# EAGLE design Breakouts1 (EAGLE 7.2.0)
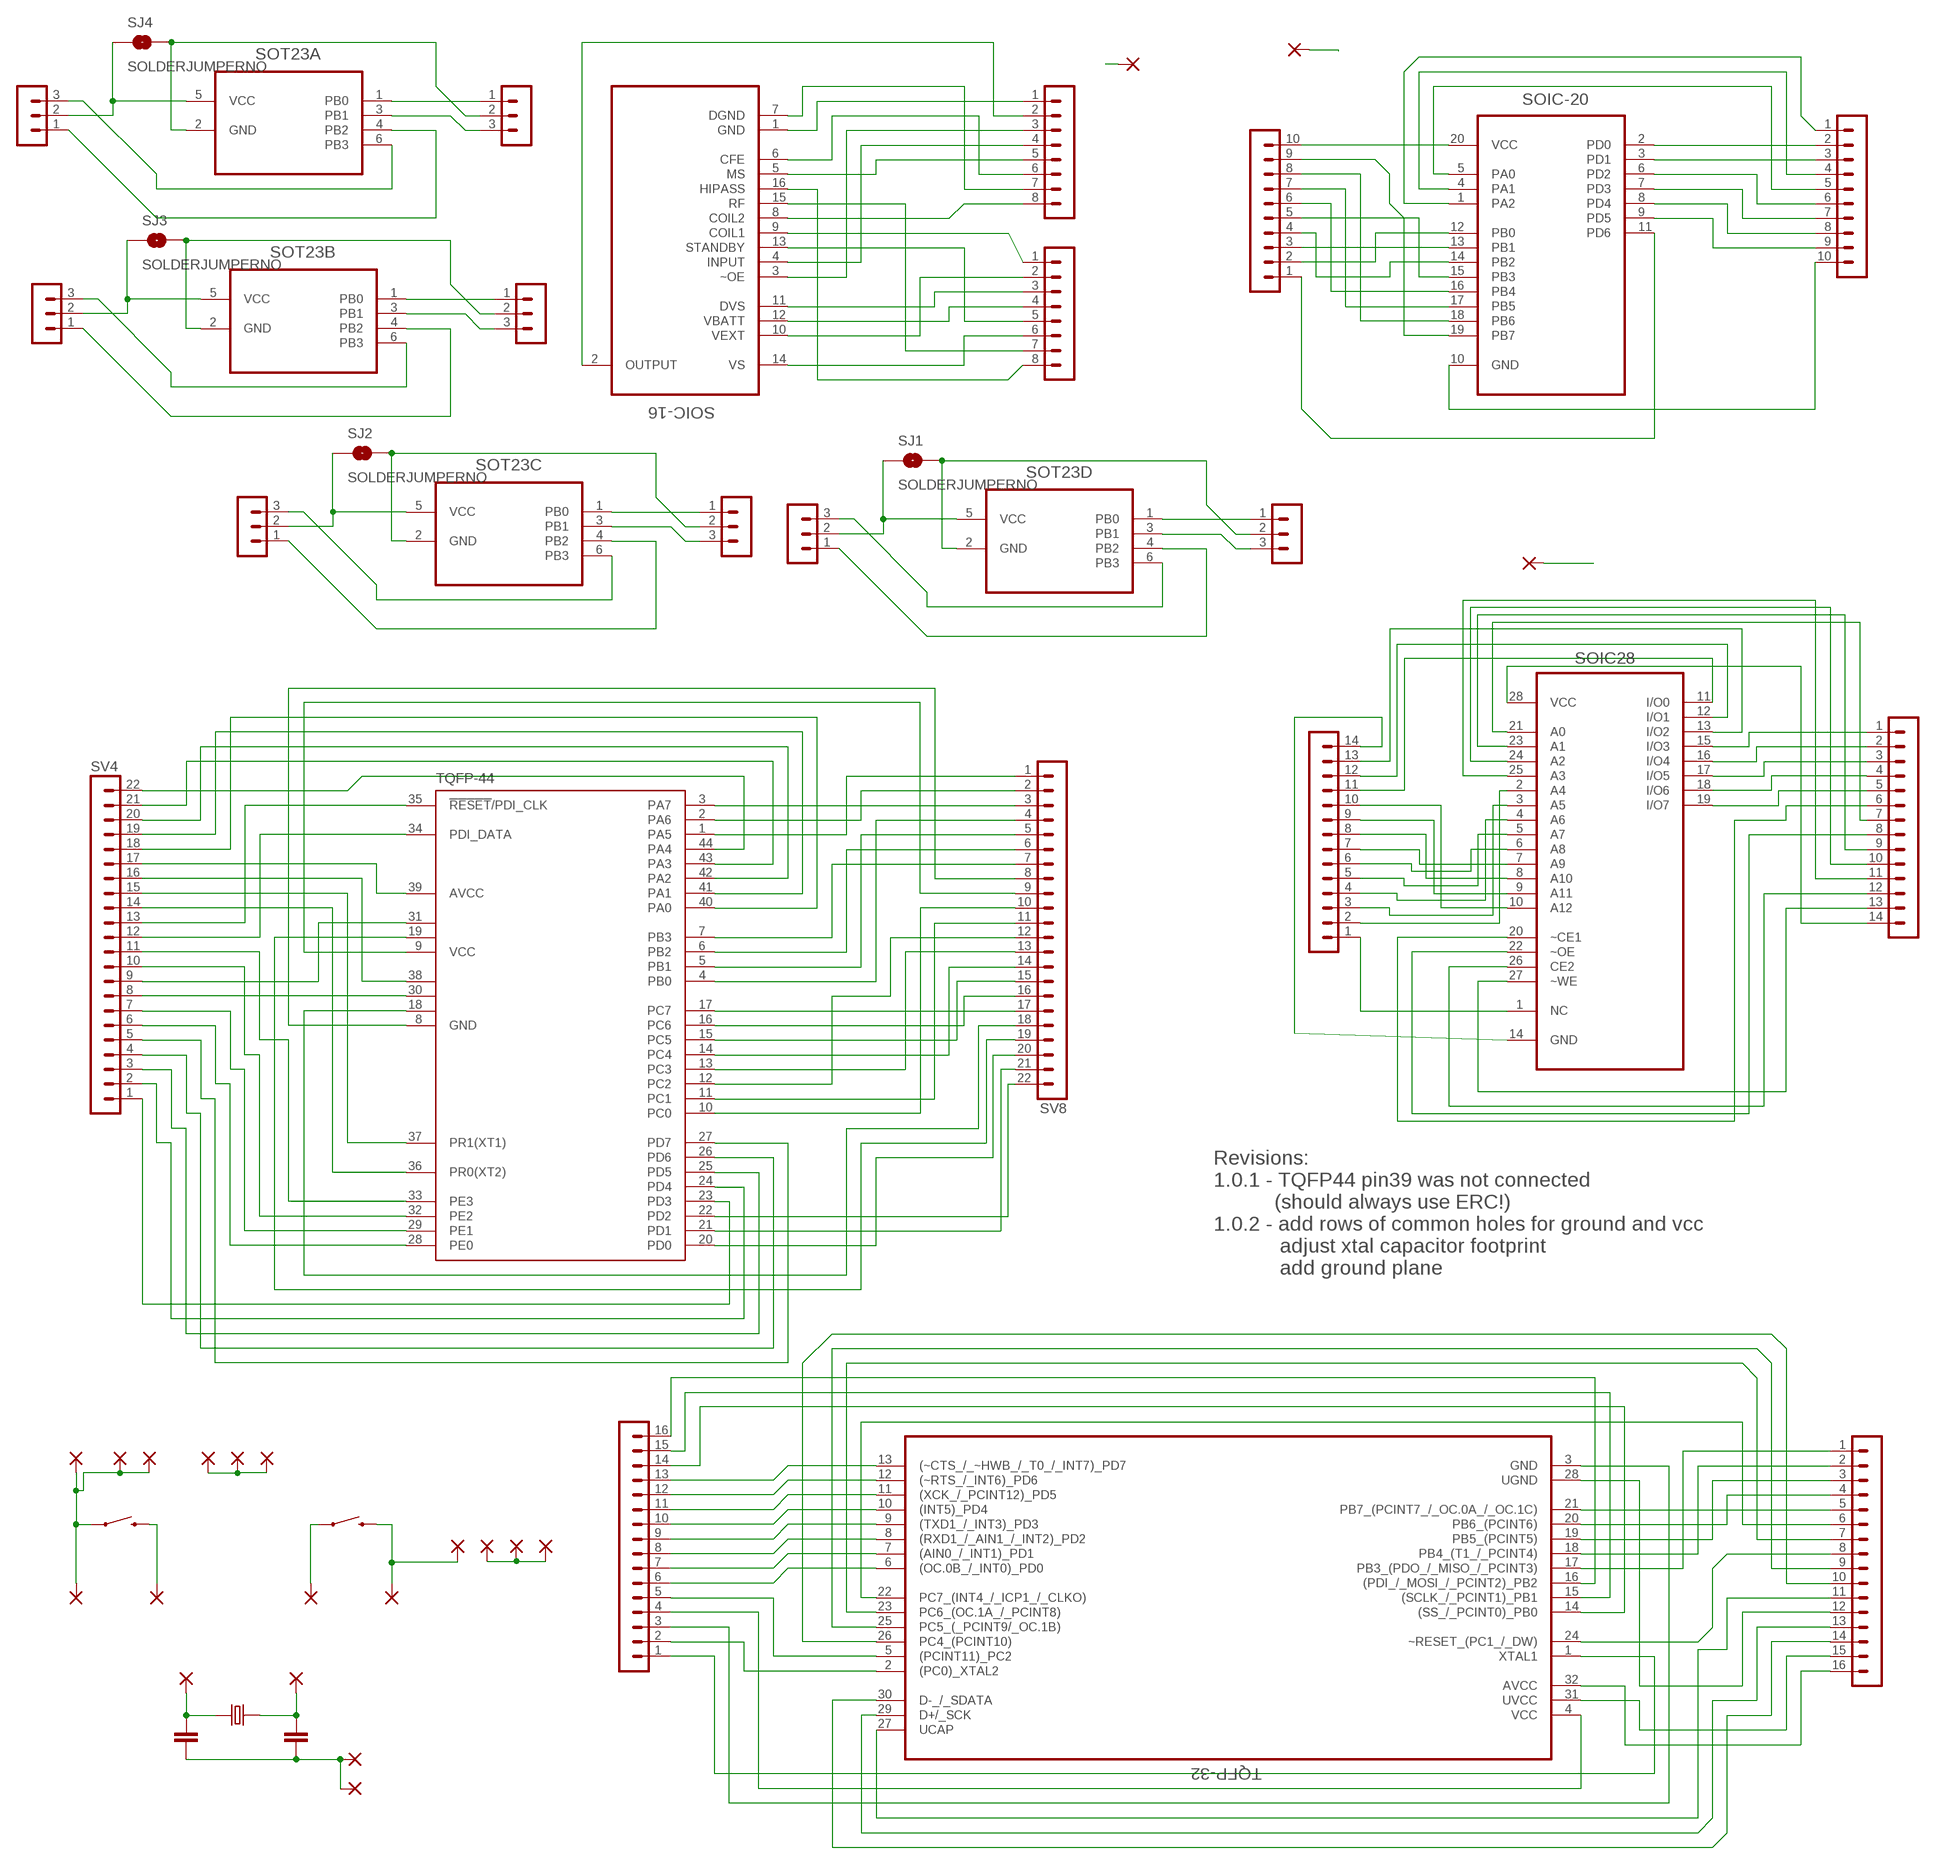
[diagram p0: schematic, sheet 1]

## Parts
C1  C-EU025-024X044**100NF+22PF  [C025-024X044]
C2  C-EU025-024X044**100NF+22PF  [C025-024X044]
PAD1  WIREPAD1,6/0,8  [1,6/0,8]
PAD2  WIREPAD1,6/0,8  [1,6/0,8]
PAD3  WIREPAD1,6/0,8  [1,6/0,8]
PAD4  WIREPAD1,6/0,8  [1,6/0,8]
PAD5  WIREPAD1,6/0,8  [1,6/0,8]
PAD6  WIREPAD1,6/0,8  [1,6/0,8]
PAD7  WIREPAD1,6/0,8  [1,6/0,8]
PAD8  WIREPAD1,6/0,8  [1,6/0,8]
PAD9  WIREPAD1,6/0,8  [1,6/0,8]
PAD10  WIREPAD1,6/0,8  [1,6/0,8]
PAD11  WIREPAD1,6/0,8  [1,6/0,8]
PAD12  WIREPAD1,6/0,8  [1,6/0,8]
PAD13  WIREPAD1,6/0,8  [1,6/0,8]
PAD14  WIREPAD1,6/0,8  [1,6/0,8]
PAD15  WIREPAD1,6/0,8  [1,6/0,8]
PAD16  WIREPAD1,6/0,8  [1,6/0,8]
PAD17  WIREPAD1,6/0,8  [1,6/0,8]
PAD18  WIREPAD1,6/0,8  [1,6/0,8]
PLANE-SOIC16  WIREPAD1,6/0,8  [1,6/0,8]
PLANE-SOIC20  WIREPAD1,6/0,8  [1,6/0,8]
PLANE-SOIC28  WIREPAD1,6/0,8  [1,6/0,8]
S1  SWITCH-MOMENTARY-2PTH  [TACTILE-PTH]
S2  SWITCH-MOMENTARY-2PTH  [TACTILE-PTH]
SJ1  SOLDERJUMPERNO  [SJ_2S-NO]
SJ2  SOLDERJUMPERNO  [SJ_2S-NO]
SJ3  SOLDERJUMPERNO  [SJ_2S-NO]
SJ4  SOLDERJUMPERNO  [SJ_2S-NO]
SOIC28  CY6264-70SNXC  [SOIC127P1193X253-28N]
SOIC-16  U2270B-MFPY  [SOIC127P600X140-16N]
SOIC-20  ATTINY2313A-SU  [SOIC127P1032X265-20N]
SOT23A  ATTINY10-TSHR  [SOT95P280X145-6N]
SOT23B  ATTINY10-TSHR  [SOT95P280X145-6N]
SOT23C  ATTINY10-TSHR  [SOT95P280X145-6N]
SOT23D  ATTINY10-TSHR  [SOT95P280X145-6N]
SV1  MA08-1  [MA08-1]
SV2  MA08-1  [MA08-1]
SV3  MA16-1  [MA16-1]
SV4  MA22-1  [MA22-1]
SV5  MA14-1  [MA14-1]
SV6  MA10-1  [MA10-1]
SV7  MA16-1  [MA16-1]
SV8  MA22-1  [MA22-1]
SV9  MA14-1  [MA14-1]
SV10  MA03-1  [MA03-1]
SV11  MA03-1  [MA03-1]
SV12  MA03-1  [MA03-1]
SV13  MA03-1  [MA03-1]
SV14  MA03-1  [MA03-1]
SV15  MA03-1  [MA03-1]
SV17  MA10-1  [MA10-1]
SV21  MA03-1  [MA03-1]
SV22  MA03-1  [MA03-1]
TQFP-32  AT90USB162-16AU  [QFP80P900X900X120-32N]
TQFP-44  XMEGA16A4A  [TQFP44]
X1  CRYSTAL-HC49U-V**16MHZ  [HC49U-V]

## Nets
GND: C1.2 C2.2 PAD2.1(P) PAD5.1(P) PAD8.1(P) PAD9.1(P) PAD10.1(P) PAD14.1(P) S1.1
N$1: SV8.1 TQFP-44.1(PA5)
N$2: SV8.2 TQFP-44.2(PA6)
N$3: SV8.3 TQFP-44.3(PA7)
N$4: SV8.4 TQFP-44.4(PB0)
N$5: SV8.5 TQFP-44.5(PB1)
N$6: SV8.6 TQFP-44.6(PB2)
N$7: SV8.7 TQFP-44.7(PB3)
N$8: SV8.8 TQFP-44.8(GND)
N$9: SV8.9 TQFP-44.9(VCC)
N$10: SV8.12 TQFP-44.12(PC2)
N$11: SV8.11 TQFP-44.11(PC1)
N$12: SV8.10 TQFP-44.10(PC0)
N$13: SV8.13 TQFP-44.13(PC3)
N$14: SV8.14 TQFP-44.14(PC4)
N$15: SV8.15 TQFP-44.15(PC5)
N$16: SV8.16 TQFP-44.16(PC6)
N$17: SV8.17 TQFP-44.17(PC7)
N$18: SV8.18 TQFP-44.18(GND1)
N$19: SV8.19 TQFP-44.19(VCC1)
N$20: SV8.20 TQFP-44.20(PD0)
N$21: SV8.21 TQFP-44.21(PD1)
N$22: SV8.22 TQFP-44.22(PD2)
N$23: SV4.1 TQFP-44.23(PD3)
N$24: SV4.2 TQFP-44.24(PD4)
N$25: SOIC28.1(NC) SV9.1
N$26: SOIC28.2(A4) SV9.2
N$27: SOIC28.3(A5) SV9.3
N$28: SOIC28.4(A6) SV9.4
N$29: SOIC28.5(A7) SV9.5
N$30: SOIC28.6(A8) SV9.6
N$31: SOIC28.7(A9) SV9.7
N$32: SOIC28.8(A10) SV9.8
N$33: SV4.3 TQFP-44.25(PD5)
N$34: SV4.4 TQFP-44.26(PD6)
N$35: SV4.5 TQFP-44.27(PD7)
N$36: SV4.6 TQFP-44.28(PE0)
N$37: SV4.7 TQFP-44.29(PE1)
N$38: SV4.8 TQFP-44.30(GND2)
N$39: SV4.9 TQFP-44.31(VCC2)
N$40: SV4.10 TQFP-44.32(PE2)
N$41: SV4.11 TQFP-44.33(PE3)
N$42: SV4.12 TQFP-44.34(PDI_DATA)
N$43: SV4.13 TQFP-44.35(!RESET!/PDI_CLK)
N$44: SV4.14 TQFP-44.36(PR0(XT2))
N$45: SV4.15 TQFP-44.37(PR1(XT1))
N$46: SOIC-20.1(PA2) SV6.1
N$47: SOIC-20.2(PD0) SV6.2
N$48: SOIC-20.3(PD1) SV6.3
N$49: SOIC-20.4(PA1) SV6.4
N$50: SOIC-20.5(PA0) SV6.5
N$51: SOIC-20.6(PD2) SV6.6
N$52: SOIC-20.7(PD3) SV6.7
N$53: SOIC-20.8(PD4) SV6.8
N$54: SOIC-20.9(PD5) SV6.9
N$55: SOIC-20.10(GND) SV6.10
N$56: SOIC-20.11(PD6) SV17.1
N$57: SOIC-20.12(PB0) SV17.2
N$58: SOIC-20.13(PB1) SV17.3
N$59: SOIC-20.14(PB2) SV17.4
N$60: SOIC-20.15(PB3) SV17.5
N$61: SOIC-20.16(PB4) SV17.6
N$62: SOIC-20.18(PB6) SV17.8
N$63: SOIC-20.19(PB7) SV17.9
N$64: SOIC-20.20(VCC) SV17.10
N$65: SV4.16 TQFP-44.38(GND3)
N$66: SV4.17 TQFP-44.39(AVCC)
N$67: SV4.18 TQFP-44.40(PA0)
N$68: SV4.19 TQFP-44.41(PA1)
N$69: SV4.20 TQFP-44.42(PA2)
N$70: SV4.21 TQFP-44.43(PA3)
N$71: SV4.22 TQFP-44.44(PA4)
N$72: SOIC-20.17(PB5) SV17.7
N$73: SV7.2 TQFP-32.2((PC0)_XTAL2)
N$74: SV7.1 TQFP-32.1(XTAL1)
N$75: SV7.5 TQFP-32.5((PCINT11)_PC2)
N$76: SV7.6 TQFP-32.6((OC.0B_/_INT0)_PD0)
N$77: SV7.7 TQFP-32.7((AIN0_/_INT1)_PD1)
N$78: SV7.8 TQFP-32.8((RXD1_/_AIN1_/_INT2)_PD2)
N$79: SV7.9 TQFP-32.9((TXD1_/_INT3)_PD3)
N$80: SV7.10 TQFP-32.10((INT5)_PD4)
N$81: SV7.11 TQFP-32.11((XCK_/_PCINT12)_PD5)
N$82: SV7.12 TQFP-32.12((~RTS_/_INT6)_PD6)
N$83: SV7.13 TQFP-32.13((~CTS_/_~HWB_/_T0_/_INT7)_PD7)
N$84: SV7.4 TQFP-32.4(VCC)
N$85: SV7.3 TQFP-32.3(GND)
N$86: SV7.16 TQFP-32.16((PDI_/_MOSI_/_PCINT2)_PB2)
N$87: SV7.15 TQFP-32.15((SCLK_/_PCINT1)_PB1)
N$88: SV7.14 TQFP-32.14((SS_/_PCINT0)_PB0)
N$89: SV3.1 TQFP-32.17(PB3_(PDO_/_MISO_/_PCINT3))
N$90: SV3.2 TQFP-32.18(PB4_(T1_/_PCINT4))
N$91: SV3.3 TQFP-32.19(PB5_(PCINT5))
N$92: SV3.4 TQFP-32.20(PB6_(PCINT6))
N$93: SV3.5 TQFP-32.21(PB7_(PCINT7_/_OC.0A_/_OC.1C))
N$94: SV3.6 TQFP-32.22(PC7_(INT4_/_ICP1_/_CLKO))
N$95: SV3.7 TQFP-32.23(PC6_(OC.1A_/_PCINT8))
N$96: SV3.8 TQFP-32.24(~RESET_(PC1_/_DW))
N$97: SV3.9 TQFP-32.25(PC5_(_PCINT9/_OC.1B))
N$98: SV3.10 TQFP-32.26(PC4_(PCINT10))
N$99: SV3.11 TQFP-32.27(UCAP)
N$100: SV3.12 TQFP-32.28(UGND)
N$101: SV3.13 TQFP-32.29(D+/_SCK)
N$102: SV3.14 TQFP-32.30(D-_/_SDATA)
N$103: SV3.15 TQFP-32.31(UVCC)
N$104: SV3.16 TQFP-32.32(AVCC)
N$105: SOIC-16.1(GND) SV1.1
N$106: SOIC-16.2(OUTPUT) SV1.2
N$107: SOIC-16.3(~OE) SV1.3
N$108: SOIC-16.4(INPUT) SV1.4
N$109: SOIC-16.5(MS) SV1.5
N$110: SOIC-16.6(CFE) SV1.6
N$111: SOIC-16.7(DGND) SV1.7
N$112: SOIC-16.8(COIL2) SV1.8
N$113: SOIC-16.9(COIL1) SV2.1
N$114: SOIC-16.10(VEXT) SV2.2
N$115: SOIC-16.11(DVS) SV2.3
N$116: SOIC-16.12(VBATT) SV2.4
N$117: SOIC-16.13(STANDBY) SV2.5
N$118: SOIC-16.14(VS) SV2.6
N$119: SOIC-16.15(RF) SV2.7
N$120: SOIC-16.16(HIPASS) SV2.8
N$121: SOT23C.1(PB0) SV22.1
N$122: SJ2.2 SOT23C.2(GND) SV22.2
N$123: SOT23C.3(PB1) SV22.3
N$124: SOT23C.4(PB2) SV21.1
N$125: SJ2.1 SOT23C.5(VCC) SV21.2
N$126: SOT23C.6(PB3) SV21.3
N$127: SOIC28.9(A11) SV9.9
N$128: SOIC28.10(A12) SV9.10
N$129: SOIC28.11(I/O0) SV9.11
N$130: SOIC28.12(I/O1) SV9.12
N$131: SOIC28.13(I/O2) SV9.13
N$132: SOIC28.14(GND) SV9.14
N$133: SOIC28.15(I/O3) SV5.1
N$134: SOIC28.16(I/O4) SV5.2
N$135: SOIC28.17(I/O5) SV5.3
N$136: SOIC28.18(I/O6) SV5.4
N$137: SOIC28.19(I/O7) SV5.5
N$138: SOIC28.20(~CE1) SV5.6
N$139: SOIC28.21(A0) SV5.7
N$140: SOIC28.22(~OE) SV5.8
N$141: SOIC28.23(A1) SV5.9
N$142: SOIC28.24(A2) SV5.10
N$143: SOIC28.25(A3) SV5.11
N$144: SOIC28.26(CE2) SV5.12
N$145: SOIC28.27(~WE) SV5.13
N$146: SOIC28.28(VCC) SV5.14
N$147: SOT23B.1(PB0) SV11.1
N$148: SJ3.2 SOT23B.2(GND) SV11.2
N$149: SOT23B.3(PB1) SV11.3
N$150: SOT23B.4(PB2) SV10.1
N$151: SJ3.1 SOT23B.5(VCC) SV10.2
N$152: SOT23B.6(PB3) SV10.3
N$153: SOT23D.1(PB0) SV13.1
N$154: SJ1.2 SOT23D.2(GND) SV13.2
N$155: SOT23D.3(PB1) SV13.3
N$156: SOT23D.4(PB2) SV12.1
N$157: SJ1.1 SOT23D.5(VCC) SV12.2
N$158: SOT23D.6(PB3) SV12.3
N$159: SOT23A.1(PB0) SV15.1
N$160: SJ4.2 SOT23A.2(GND) SV15.2
N$161: SOT23A.3(PB1) SV15.3
N$162: SOT23A.4(PB2) SV14.1
N$163: SJ4.1 SOT23A.5(VCC) SV14.2
N$164: SOT23A.6(PB3) SV14.3
N$166: PAD1.1(P) S1.3
N$167: PAD4.1(P) S2.1
N$169: C2.1 PAD6.1(P) X1.1
N$170: C1.1 PAD7.1(P) X1.2
N$171: PAD16.1(P) PAD17.1(P) PAD18.1(P)
N$173: PAD11.1(P) PAD12.1(P) PAD13.1(P)
PLANE-SOIC16: PLANE-SOIC16.1(P)
PLANE-SOIC20: PLANE-SOIC20.1(P)
PLANE-SOIC28: PLANE-SOIC28.1(P)
PLANE-TQFP32: PAD3.1(P) PAD15.1(P) S2.3

## Notes on the sheet
- Revisions:
  1.0.1 - TQFP44 pin39 was not connected
             (should always use ERC!)
  1.0.2 - add rows of common holes for ground and vcc
              adjust xtal capacitor footprint
              add ground plane

## Library data of the parts
C1 C2 = Astronomical Clocks old:C-EU: CAPACITOR, European symbol
PAD1-PAD18 PLANE-SOIC16 PLANE-SOIC20 PLANE-SOIC28 = Astronomical Clocks old:WIREPAD: Wire PAD connect wire on PCB
S1 S2 = SMD Pads:SWITCH-MOMENTARY-2: Various NO switches- pushbuttons, reed, etc
SJ1-SJ4 = Astronomical Clocks:SOLDERJUMPER: Solder Jumper Standard SMD solder jumper. Used to automate production. Two varients : Normally Open and Normally Closed are the same, but have different paste layers. NC will have a large amount of paste and should jumper during reflow.
SOIC28 = SMD Pads:CY6264-70SNXC: 8K x 8 Static RAM; DESCRIPTION: 8K x 8 Static RAM; MPN: CY6264-70SNXC; OC_FARNELL: 8911460; OC_NEWARK: 19M2607; PACKAGE: SOIC-28; SUPPLIER: CYPRESS SEMICONDUCTOR
SOIC-16 = Atmel_By_element14_Batch_1:U2270B-MFPY: Read/Write Base Station; MPN: U2270B-MFPY; OC_FARNELL: 1095806; OC_NEWARK: 93K1097; PACKAGE: SOIC-16; SUPPLIER: ATMEL
SOIC-20 = Atmel_By_element14_Batch_1:ATTINY2313A-SU: 8-bit Microcontroller with In-System Programmable Flash; MPN: ATTINY2313A-SU; OC_FARNELL: 1841617; OC_NEWARK: 12T1334; PACKAGE: SOIC-20; SUPPLIER: Atmel
SOT23A SOT23B SOT23C SOT23D = Atmel_By_element14_Batch_1:ATTINY10-TSHR: 8-bit Microcontroller with In-System Programmable Flash; MPN: ATTINY10-TSHR; OC_FARNELL: 1748538; OC_NEWARK: 26R5645; PACKAGE: SOT-23-6; SUPPLIER: Atmel
SV1 SV2 = SMD Pads:MA08-1: PIN HEADER; OC_FARNELL: unknown; OC_NEWARK: unknown
SV3 SV7 = SMD Pads:MA16-1: PIN HEADER; OC_FARNELL: unknown; OC_NEWARK: unknown
SV4 SV8 = SMD Pads:MA22-1: PIN HEADER; OC_FARNELL: unknown; OC_NEWARK: unknown
SV5 SV9 = SMD Pads:MA14-1: PIN HEADER; OC_FARNELL: unknown; OC_NEWARK: unknown
SV6 SV17 = SMD Pads:MA10-1: PIN HEADER; OC_FARNELL: unknown; OC_NEWARK: unknown
SV10-SV15 SV21 SV22 = SMD Pads:MA03-1: PIN HEADER; OC_FARNELL: unknown; OC_NEWARK: unknown
TQFP-32 = Atmel_By_element14_Batch_1:AT90USB162-16AU: 8-bit Microcontroller; MPN: AT90USB162-16AU; OC_FARNELL: 1455073; OC_NEWARK: 58M3868; PACKAGE: TQFP-32; SUPPLIER: Atmel
TQFP-44 = atmel:XMEGA16A4: MICROCONTROLLER Features High-performance, Low-power 8/16-bit AVR XMEGA Microcontroller Non-Volatile Program and Data Memories - 16 KB - 128 KB of In-System Self-Programmable Flash - 4 KB - 8 KB Boot Code Section with Independent Lock Bits - 1 KB - 2 KB EEPROM - 2 KB - 8 KB Internal SRAM Peripheral Features - Four-channel DMA Controller with support for external requests - Eight-channel Event System - Five 16-bit Timer/Counters Three Timer/Counters with 4 Output Compare or Input Capture channels Two Timer/Counters with 2 Output Compare or Input Capture channels High-Resolution Extensions on all Timer/Counters Advanced Waveform Extension on one Timer/Counter - Five USARTs IrDA Extension on one USART - Two Two-Wire Interfaces with dual address match (I2C and SMBus compatible) - Two SPIs (Serial Peripheral Interfaces) peripherals - AES and DES Crypto Engine - 16-bit Real Time Counter with Separate Oscillator - One Twelve-channel, 12-bit, 2 Msps Analog to Digital Converter - One Two-channel, 12-bit, 1 Msps Digital to Analog Converter - Two Analog Comparators with Window compare function - External Interrupts on all General Purpose I/O pins - Programmable Watchdog Timer with Separate On-chip Ultra Low Power Oscillator Special Microcontroller Features - Power-on Reset and Programmable Brown-out Detection - Internal and External Clock Options with PLL - Programmable Multi-level Interrupt Controller - Sleep Modes: Idle, Power-down, Standby, Power-save, Extended Standby - Advanced Programming, Test and Debugging Interfaces PDI (Program and Debug Interface) for programming, test and debugging I/O and Packages - 34 Programmable I/O Lines - 44 - lead TQFP - 44 - pad VQFN/QFN - 49 - ball VFBGA Operating Voltage - 1.6 - 3.6V Speed performance - 0 - 12 MHz @ 1.6 - 3.6V - 0 - 32 MHz @ 2.7 - 3.6V Drawn by Dipl.-Ing. (FH) Robert Siegler Created: 27.05.09; OC_FARNELL: unknown; OC_NEWARK: unknown
X1 = Astronomical Clocks old:CRYSTAL*: CRYSTAL

## Board
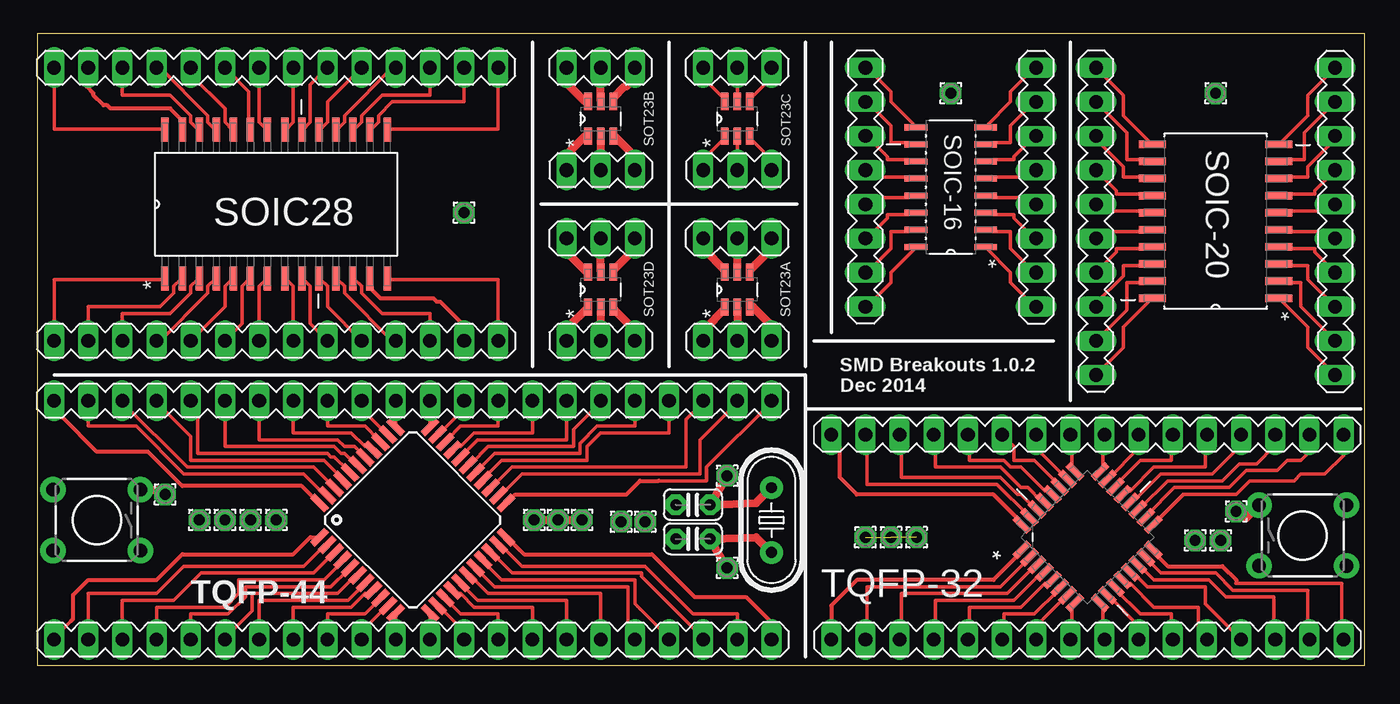
[diagram p1: board, top side]
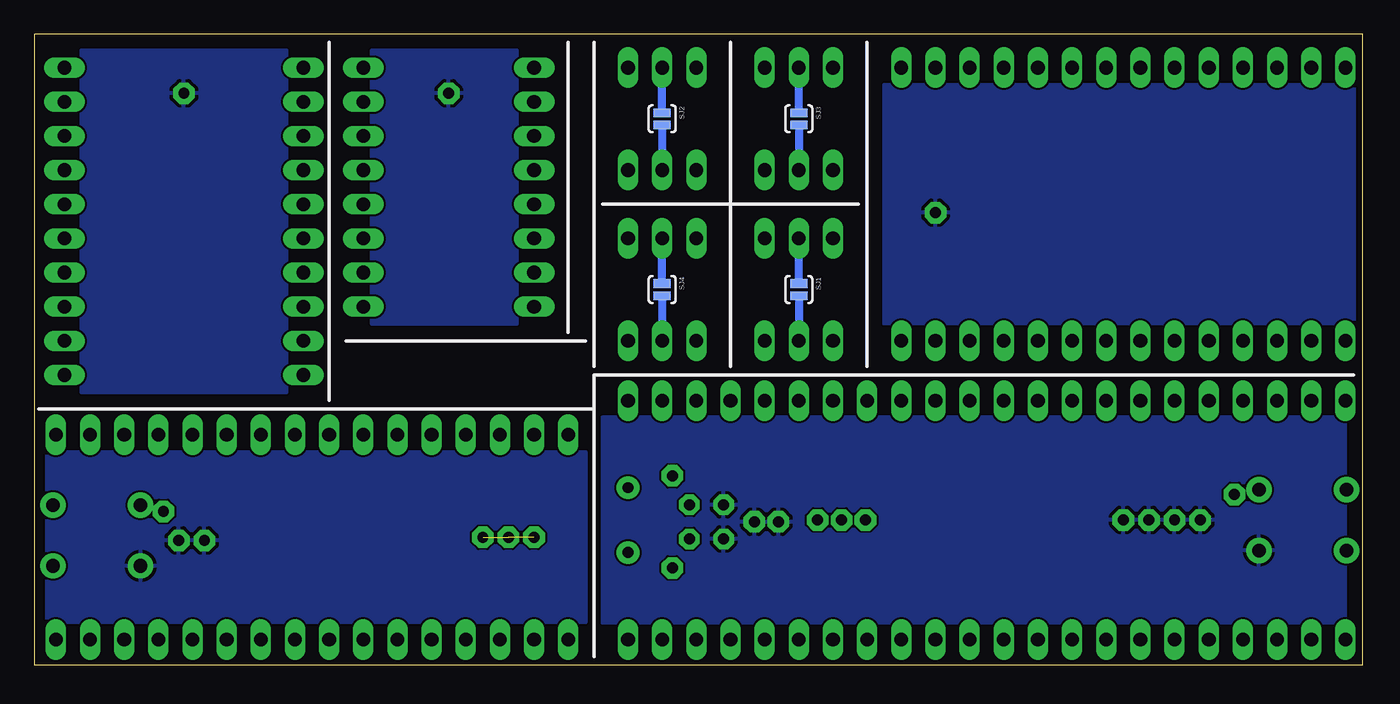
[diagram p2: board, bottom side, seen from below]

Size 98.73 x 46.98 mm. Coordinates in mm from the lower left corner, seen from the top.
Outline: 0,0 98.73,0 98.73,46.98 0,46.98 0,0
Copper layers (1*16): Top 0.035mm / dielectric 1.5mm / Bottom 0.035mm
Design rules "Seeed Fusion_eagle_rule_v1.1 *": minimum track width 10mil, minimum drill 12mil, track to track 6mil, track to pad 6mil, pad to pad 6mil, via to via 6mil, smd to smd 0mil, copper to edge 10mil, drill to drill 10mil, minimum pad ring 10mil, minimum via ring 6mil, stop-mask expansion 2mil, vias tented up to drill 100mil, thermal gap 10mil

### Footprints (pad centres in the part's own frame; a part is rotated, then mirrored left to right if it is on the bottom)
C025-024X044 = drill 0.813 pad 1.524 octagon: 1 -1.27,0; 2 1.27,0
1,6/0,8 = drill 0.813 pad 1.6 octagon: 1 0,0
TACTILE-PTH = drill 1.016 pad 1.88: 1 -3.251,2.261; 2 3.251,2.261; 3 -3.251,-2.261; 4 3.251,-2.261
SJ_2S-NO = smd 0.635 x 1.27: 1 -0.45,0; 2 0.45,0
SOIC127P1193X253-28N = smd 1.778 x 0.559: 1 -5.537,8.255; 2 -5.537,6.985; 3 -5.537,5.715; 4 -5.537,4.445; 5 -5.537,3.175; 6 -5.537,1.905; 7 -5.537,0.635; 8 -5.537,-0.635; 9 -5.537,-1.905; 10 -5.537,-3.175; 11 -5.537,-4.445; 12 -5.537,-5.715; 13 -5.537,-6.985; 14 -5.537,-8.255; 15 5.537,-8.255; 16 5.537,-6.985; 17 5.537,-5.715; 18 5.537,-4.445; 19 5.537,-3.175; 20 5.537,-1.905; 21 5.537,-0.635; 22 5.537,0.635; 23 5.537,1.905; 24 5.537,3.175; 25 5.537,4.445; 26 5.537,5.715; 27 5.537,6.985; 28 5.537,8.255
SOIC127P600X140-16N = smd 1.702 x 0.457: 1 -2.591,4.445; 2 -2.591,3.175; 3 -2.591,1.905; 4 -2.591,0.635; 5 -2.591,-0.635; 6 -2.591,-1.905; 7 -2.591,-3.175; 8 -2.591,-4.445; 9 2.591,-4.445; 10 2.591,-3.175; 11 2.591,-1.905; 12 2.591,-0.635; 13 2.591,0.635; 14 2.591,1.905; 15 2.591,3.175; 16 2.591,4.445
SOIC127P1032X265-20N = smd 1.981 x 0.559: 1 -4.699,5.715; 2 -4.699,4.445; 3 -4.699,3.175; 4 -4.699,1.905; 5 -4.699,0.635; 6 -4.699,-0.635; 7 -4.699,-1.905; 8 -4.699,-3.175; 9 -4.699,-4.445; 10 -4.699,-5.715; 11 4.699,-5.715; 12 4.699,-4.445; 13 4.699,-3.175; 14 4.699,-1.905; 15 4.699,-0.635; 16 4.699,0.635; 17 4.699,1.905; 18 4.699,3.175; 19 4.699,4.445; 20 4.699,5.715
SOT95P280X145-6N = smd 1.27 x 0.559: 1 -1.295,0.94; 2 -1.295,0; 3 -1.295,-0.94; 4 1.295,-0.94; 5 1.295,0; 6 1.295,0.94
MA08-1 = drill 1.016 long: 1 -8.89,0; 2 -6.35,0; 3 -3.81,0; 4 -1.27,0; 5 1.27,0; 6 3.81,0; 7 6.35,0; 8 8.89,0
MA16-1 = drill 1.016 long: 1 -24.13,0; 2 -21.59,0; 3 -19.05,0; 4 -16.51,0; 5 -13.97,0; 6 -11.43,0; 7 -8.89,0; 8 -6.35,0; 9 -3.81,0; 10 -1.27,0; 11 1.27,0; 12 3.81,0; 13 6.35,0; 14 8.89,0; 15 11.43,0; 16 13.97,0
MA22-1 = drill 1.016 long: 1 -26.67,0; 2 -24.13,0; 3 -21.59,0; 4 -19.05,0; 5 -16.51,0; 6 -13.97,0; 7 -11.43,0; 8 -8.89,0; 9 -6.35,0; 10 -3.81,0; 11 -1.27,0; 12 1.27,0; 13 3.81,0; 14 6.35,0; 15 8.89,0; 16 11.43,0; 17 13.97,0; 18 16.51,0; 19 19.05,0; 20 21.59,0; 21 24.13,0; 22 26.67,0
MA14-1 = drill 1.016 long: 1 -16.51,0; 2 -13.97,0; 3 -11.43,0; 4 -8.89,0; 5 -6.35,0; 6 -3.81,0; 7 -1.27,0; 8 1.27,0; 9 3.81,0; 10 6.35,0; 11 8.89,0; 12 11.43,0; 13 13.97,0; 14 16.51,0
MA10-1 = drill 1.016 long: 1 -11.43,0; 2 -8.89,0; 3 -6.35,0; 4 -3.81,0; 5 -1.27,0; 6 1.27,0; 7 3.81,0; 8 6.35,0; 9 8.89,0; 10 11.43,0
MA03-1 = drill 1.016 long: 1 -2.54,0; 2 0,0; 3 2.54,0
QFP80P900X900X120-32N = smd 1.473 x 0.508: 1 -4.115,2.794; 2 -4.115,2.007; 3 -4.115,1.194; 4 -4.115,0.406; 5 -4.115,-0.406; 6 -4.115,-1.194; 7 -4.115,-2.007; 8 -4.115,-2.794; 17 4.115,-2.794; 18 4.115,-2.007; 19 4.115,-1.194; 20 4.115,-0.406; 21 4.115,0.406; 22 4.115,1.194; 23 4.115,2.007; 24 4.115,2.794 | smd 0.508 x 1.473: 9 -2.794,-4.115; 10 -2.007,-4.115; 11 -1.194,-4.115; 12 -0.406,-4.115; 13 0.406,-4.115; 14 1.194,-4.115; 15 2.007,-4.115; 16 2.794,-4.115; 25 2.794,4.115; 26 2.007,4.115; 27 1.194,4.115; 28 0.406,4.115; 29 -0.406,4.115; 30 -1.194,4.115; 31 -2.007,4.115; 32 -2.794,4.115
TQFP44 = smd 1.5 x 0.5: 1 -5.8,4; 2 -5.8,3.2; 3 -5.8,2.4; 4 -5.8,1.6; 5 -5.8,0.8; 6 -5.8,0; 7 -5.8,-0.8; 8 -5.8,-1.6; 9 -5.8,-2.4; 10 -5.8,-3.2; 11 -5.8,-4; 23 5.8,-4; 24 5.8,-3.2; 25 5.8,-2.4; 26 5.8,-1.6; 27 5.8,-0.8; 28 5.8,0; 29 5.8,0.8; 30 5.8,1.6; 31 5.8,2.4; 32 5.8,3.2; 33 5.8,4 | smd 0.5 x 1.5: 12 -4,-5.8; 13 -3.2,-5.8; 14 -2.4,-5.8; 15 -1.6,-5.8; 16 -0.8,-5.8; 17 0,-5.8; 18 0.8,-5.8; 19 1.6,-5.8; 20 2.4,-5.8; 21 3.2,-5.8; 22 4,-5.8; 34 4,5.8; 35 3.2,5.8; 36 2.4,5.8; 37 1.6,5.8; 38 0.8,5.8; 39 0,5.8; 40 -0.8,5.8; 41 -1.6,5.8; 42 -2.4,5.8; 43 -3.2,5.8; 44 -4,5.8
HC49U-V = drill 0.813 pad 1.676: 1 -2.413,0; 2 2.413,0

### Placement (x,y rotation side)
C1  48.77,9.4 180 top
C2  48.77,11.94 180 top
PAD1  9.53,12.7 0 top
PAD2  12.06,10.79 0 top
PAD3  88.01,9.27 0 top
PAD4  89.15,11.43 0 top
PAD5  13.97,10.79 0 top
PAD6  51.31,14.1 0 top
PAD7  51.31,7.24 0 top
PAD8  45.21,10.67 0 top
PAD9  15.88,10.79 0 top
PAD10  17.78,10.79 0 top
PAD11  38.73,10.79 0 top
PAD12  40.51,10.79 0 top
PAD13  36.96,10.79 0 top
PAD14  43.43,10.67 0 top
PAD15  86.11,9.27 0 top
PAD16  61.59,9.53 0 top
PAD17  63.5,9.53 0 top
PAD18  65.41,9.53 0 top
PLANE-SOIC16  67.94,42.55 0 top
PLANE-SOIC20  87.63,42.55 0 top
PLANE-SOIC28  31.75,33.66 0 top
S1  4.45,10.79 180 top
S2  94.11,9.65 0 top
SJ1  41.91,27.94 270 bottom
SJ2  52.07,40.64 270 bottom
SJ3  41.91,40.64 270 bottom
SJ4  52.07,27.94 270 bottom
SOIC28  17.78,34.29 90 top
SOIC-16  67.94,35.56 180 top
SOIC-20  87.63,33.02 180 top
SOT23A  52.07,27.94 90 top
SOT23B  41.91,40.64 90 top
SOT23C  52.07,40.64 90 top
SOT23D  41.91,27.94 90 top
SV1  74.3,35.56 90 top
SV2  61.59,35.56 270 top
SV3  73.03,17.14 180 top
SV4  27.94,19.68 180 top
SV5  17.78,44.45 180 top
SV6  96.52,33.02 90 top
SV7  83.19,1.91 0 top
SV8  27.94,1.91 0 top
SV9  17.78,24.13 0 top
SV10  41.91,44.45 180 top
SV11  41.91,36.83 0 top
SV12  41.91,31.75 180 top
SV13  41.91,24.13 0 top
SV14  52.07,31.75 180 top
SV15  52.07,24.13 0 top
SV17  78.74,33.02 270 top
SV21  52.07,44.45 180 top
SV22  52.07,36.83 0 top
TQFP-32  78.11,9.53 45 top
TQFP-44  27.94,10.79 45 top
X1  54.61,10.79 270 top

### Tracks (layer width: path | path; a pad name or v marks a point on that pad's centre or on a via)
GND
  pour Bottom: 1.27,3.17 1.27,18.41 56.52,18.41 56.52,3.17
N$1
  Top 0.254: 2.54,3.3 1.27,2.03 SV8.1
  Top 0.305: 2.54,3.3 2.67,3.43 2.67,5.21 3.81,6.35 8.89,6.35 10.79,8.26 19.05,8.26 20.32,9.52 TQFP-44.1
N$2
  Top 0.254: SV8.2 3.81,5.33 8.89,5.33 10.92,7.37 19.81,7.37 21.34,8.89 TQFP-44.2
N$3
  Top 0.254: SV8.3 6.35,4.83 10.16,4.83 12.19,6.86 20.57,6.86 22.1,8.38 TQFP-44.3
N$4
  Top 0.254: SV8.4 8.89,4.32 13.97,4.32 14.99,5.33 14.99,6.35 21.34,6.35 22.61,7.62 TQFP-44.4
N$5
  Top 0.254: SV8.5 11.43,3.81 14.22,3.81 15.49,5.08 15.49,5.84 21.84,5.84 23.11,7.11 TQFP-44.5
N$6
  Top 0.254: TQFP-44.6 23.62,6.6 22.35,5.33 16,5.33 16,4.06 13.97,2.03 SV8.6
N$7
  Top 0.254: SV8.7 16.51,4.83 23.11,4.83 24.38,6.1 TQFP-44.7
N$8
  Top 0.254: SV8.8 19.05,4.32 23.37,4.32 24.38,5.33 24.89,5.33 TQFP-44.8
N$9
  Top 0.254: SV8.9 21.59,3.81 24.38,3.81 25.4,4.83 TQFP-44.9
N$10
  Top 0.254: SV8.12 29.21,3.81 TQFP-44.12
N$11
  Top 0.254: SV8.11 26.67,3.81 TQFP-44.11
N$12
  Top 0.254: SV8.10 24.13,2.54 25.91,4.32 TQFP-44.10
N$13
  Top 0.254: SV8.13 31.75,2.54 29.97,4.32 TQFP-44.13
N$14
  Top 0.254: SV8.14 34.29,3.81 31.5,3.81 30.48,4.83 TQFP-44.14
N$15
  Top 0.254: SV8.15 36.83,4.32 32.51,4.32 31.5,5.33 30.99,5.33 TQFP-44.15
N$16
  Top 0.254: SV8.16 39.37,4.83 32.77,4.83 31.5,6.1 TQFP-44.16
N$17
  Top 0.254: SV8.17 41.91,5.33 33.53,5.33 32.26,6.6 TQFP-44.17
N$18
  Top 0.254: TQFP-44.18 32.77,7.11 34.04,5.84 43.94,5.84 43.94,2.54 44.45,2.03 SV8.18
N$19
  Top 0.254: TQFP-44.19 33.27,7.62 34.54,6.35 44.45,6.35 44.45,4.57 46.99,2.03 SV8.19
N$20
  Top 0.254: TQFP-44.20 33.78,8.38 35.31,6.86 44.96,6.86 44.96,6.6 49.53,2.03 SV8.20
N$21
  Top 0.254: SV8.21 52.07,3.81 48.77,3.81 45.21,7.37 36.07,7.37 34.54,8.89 TQFP-44.21
N$22
  Top 0.254: SV8.22 54.61,3.17 | 35.05,9.4 TQFP-44.22
  Top 0.305: 35.05,9.4 36.2,8.26 45.72,8.26 48.9,5.08 52.7,5.08 54.61,3.17
N$23
  Top 0.254: 46.23,13.72 49.78,13.72 49.78,14.73 54.61,19.56 SV4.1 | 35.05,12.19 TQFP-44.23
  Top 0.305: 35.05,12.19 35.56,12.7 43.81,12.7 44.83,13.72 46.23,13.72
N$24
  Top 0.254: TQFP-44.24 34.54,12.7 36.07,14.22 49.28,14.22 49.28,16.76 52.07,19.56 SV4.2
N$25
  Top 0.254: SV9.1 1.27,28.7 9.4,28.7 SOIC28.1
N$26
  Top 0.254: SV9.2 3.81,26.67 9.14,26.67 10.16,27.69 10.16,28.19 10.67,28.7 SOIC28.2
N$27
  Top 0.254: SV9.3 6.35,26.16 9.91,26.16 11.43,27.69 11.43,28.19 11.94,28.7 SOIC28.3
N$28
  Top 0.254: SV9.4 9.14,24.13 12.7,27.69 12.7,28.19 13.21,28.7 SOIC28.4
N$29
  Top 0.254: SV9.5 13.97,26.67 13.97,28.19 14.48,28.7 SOIC28.5
N$30
  Top 0.254: SV9.6 15.24,25.4 15.24,28.19 15.75,28.7 SOIC28.6
N$31
  Top 0.254: SV9.7 16.51,28.19 17.02,28.7 SOIC28.7
N$32
  Top 0.254: SV9.8 19.05,28.19 18.54,28.7 SOIC28.8
N$33
  Top 0.254: TQFP-44.25 33.78,13.21 35.31,14.73 48.26,14.73 48.26,18.29 49.53,19.56 SV4.3
N$34
  Top 0.254: SV4.4 46.99,17.27 41.91,17.27 40.89,16.26 40.89,15.24 34.54,15.24 33.27,13.97 TQFP-44.26
N$35
  Top 0.254: SV4.5 44.45,17.78 41.66,17.78 40.39,16.51 40.39,15.75 34.04,15.75 32.77,14.48 TQFP-44.27
N$36
  Top 0.254: TQFP-44.28 32.26,14.99 33.53,16.26 39.88,16.26 39.88,17.53 41.91,19.56 SV4.6
N$37
  Top 0.254: SV4.7 39.37,16.76 32.77,16.76 31.5,15.49 TQFP-44.29
N$38
  Top 0.254: SV4.8 36.83,17.27 32.51,17.27 31.5,16.26 30.99,16.26 TQFP-44.30
N$39
  Top 0.254: SV4.9 34.29,17.78 31.5,17.78 30.48,16.76 TQFP-44.31
N$40
  Top 0.254: SV4.10 31.75,19.05 29.97,17.27 TQFP-44.32
N$41
  Top 0.254: SV4.11 29.21,17.78 TQFP-44.33
N$42
  Top 0.254: SV4.12 26.67,17.78 TQFP-44.34
N$43
  Top 0.254: SV4.13 24.13,19.05 25.91,17.27 TQFP-44.35
N$44
  Top 0.254: SV4.14 21.59,17.78 24.38,17.78 25.4,16.76 TQFP-44.36
N$45
  Top 0.254: SV4.15 19.05,17.27 23.37,17.27 24.38,16.26 24.89,16.26 TQFP-44.37
N$46
  Top 0.254: SOIC-20.1 94.49,25.15 94.49,23.62 SV6.1
N$47
  Top 0.254: SV6.2 93.98,26.67 93.98,28.45 92.46,28.45 SOIC-20.2
N$48
  Top 0.254: SV6.3 94.49,28.7 94.49,29.72 92.46,29.72 SOIC-20.3
N$49
  Top 0.254: SV6.4 95,30.73 95,30.99 92.46,30.99 SOIC-20.4
N$50
  Top 0.254: SV6.5 96.52,32.26 92.46,32.26 SOIC-20.5
N$51
  Top 0.254: SV6.6 96.52,33.78 92.46,33.78 SOIC-20.6
N$52
  Top 0.254: SV6.7 95,35.31 95,35.05 92.46,35.05 SOIC-20.7
N$53
  Top 0.254: SV6.8 96.52,39.12 94.49,37.08 94.49,36.32 92.46,36.32 SOIC-20.8
N$54
  Top 0.254: SV6.9 94.23,39.62 94.23,37.59 92.46,37.59 SOIC-20.9
N$55
  Top 0.254: SOIC-20.10 94.49,40.89 94.49,42.42 SV6.10
N$56
  Top 0.254: SOIC-20.11 80.77,40.89 80.77,42.42 SV17.1
N$57
  Top 0.254: SV17.2 81.03,39.62 81.03,37.59 82.8,37.59 SOIC-20.12
N$58
  Top 0.254: SV17.3 78.74,39.12 80.77,37.08 80.77,36.32 82.8,36.32 SOIC-20.13
N$59
  Top 0.254: SV17.4 80.26,35.31 80.26,35.05 82.8,35.05 SOIC-20.14
N$60
  Top 0.254: SV17.5 78.74,33.78 82.8,33.78 SOIC-20.15
N$61
  Top 0.254: SV17.6 78.74,32.26 82.8,32.26 SOIC-20.16
N$62
  Top 0.254: SV17.8 78.74,26.92 80.77,28.96 80.77,29.72 82.8,29.72 SOIC-20.18
N$63
  Top 0.254: SV17.9 81.03,26.42 81.03,28.45 82.8,28.45 SOIC-20.19
N$64
  Top 0.254: SOIC-20.20 80.77,25.15 80.77,23.62 SV17.10
N$65
  Top 0.254: TQFP-44.38 24.38,15.49 23.62,16.26 22.86,16.26 22.35,16.76 16.51,16.76 SV4.16
N$66
  Top 0.254: SV4.17 13.97,16.26 22.1,16.26 22.61,15.75 22.86,15.75 23.62,14.99 TQFP-44.39
N$67
  Top 0.254: TQFP-44.40 23.11,14.48 22.1,15.49 21.84,15.49 21.59,15.75 11.94,15.75 11.94,19.05 11.43,19.56 SV4.18
N$68
  Top 0.254: TQFP-44.41 22.61,13.97 21.34,15.24 11.43,15.24 11.43,17.02 8.89,19.56 SV4.19
N$69
  Top 0.254: TQFP-44.42 22.1,13.21 20.57,14.73 11.18,14.73 6.35,19.56 SV4.20
N$70
  Top 0.254: SV4.21 3.81,17.78 7.37,17.78 10.92,14.22 19.81,14.22 21.34,12.7 TQFP-44.43
N$71
  Top 0.254: 20.83,12.19 TQFP-44.44
  Top 0.305: 20.83,12.19 19.68,13.34 10.79,13.34 8.26,15.88 4.45,15.88 1.91,18.41 1.27,18.41 SV4.22
N$72
  Top 0.254: SV17.7 80.26,30.73 80.26,30.99 82.8,30.99 SOIC-20.17
N$73
  Top 0.254: TQFP-32.2 73.66,7.87 71.63,5.84 61.72,5.84 61.72,2.03 SV7.2
N$74
  Top 0.254: 73.15,8.38 TQFP-32.1 | 59.18,2.03 SV7.1
  Top 0.305: 73.15,8.38 71.12,6.35 60.96,6.35 59.05,4.45 SV7.1
N$75
  Top 0.254: TQFP-32.5 75.44,6.1 74.93,6.1 73.15,4.32 69.34,4.32 69.34,2.03 SV7.5
N$76
  Top 0.254: TQFP-32.6 75.95,5.59 74.17,3.81 71.88,3.81 71.88,2.03 SV7.6
N$77
  Top 0.254: TQFP-32.7 76.45,5.08 74.42,3.05 74.42,2.03 SV7.7
N$78
  Top 0.254: TQFP-32.8 76.96,4.57 76.96,2.03 SV7.8
N$79
  Top 0.254: TQFP-32.9 79.25,4.57 79.25,2.03 SV7.9
N$80
  Top 0.254: TQFP-32.10 79.76,5.08 81.79,3.05 81.79,2.03 SV7.10
N$81
  Top 0.254: TQFP-32.11 80.26,5.59 82.04,3.81 84.33,3.81 84.33,2.03 SV7.11
N$82
  Top 0.254: SV7.12 86.36,2.54 86.36,4.32 83.06,4.32 81.28,6.1 80.77,6.1 TQFP-32.12
N$83
  Top 0.254: SV7.13 86.87,4.57 86.87,5.84 82.55,5.84 81.53,6.86 TQFP-32.13
N$84
  Top 0.254: TQFP-32.4 74.68,6.86 72.64,4.83 66.8,4.83 66.8,2.03 SV7.4
N$85
  Top 0.254: TQFP-32.3 74.17,7.37 72.14,5.33 64.26,5.33 64.26,2.03 SV7.3
N$86
  Top 0.254: 89.15,6.1 97.03,6.1 97.03,2.03 SV7.16 | 83.06,8.38 TQFP-32.16
  Top 0.305: 83.06,8.38 84.07,7.37 88.14,7.37 89.15,6.35 89.15,6.1
N$87
  Top 0.254: TQFP-32.15 82.55,7.87 83.57,6.86 87.63,6.86 88.9,5.59 94.49,5.59 94.49,2.03 SV7.15
N$88
  Top 0.254: TQFP-32.14 82.04,7.37 83.06,6.35 87.12,6.35 88.39,5.08 91.95,5.08 91.95,2.03 SV7.14
N$89
  Top 0.254: 85.23,12.7 89.15,12.7 90.17,13.72 93.47,13.72 93.98,14.22 95.76,14.22 97.16,15.62 SV3.1
  Top 0.305: TQFP-32.17 85.23,12.7
N$90
  Top 0.254: TQFP-32.18 82.55,11.18 84.58,13.21 88.65,13.21 89.92,14.48 92.2,14.48 92.96,15.24 93.98,15.24 94.74,16 94.61,16.13 SV3.2 94.49,17.02
N$91
  Top 0.254: TQFP-32.19 82.04,11.68 84.07,13.72 88.14,13.72 89.41,14.99 90.68,14.99 91.95,16.26 91.95,17.02 SV3.3
N$92
  Top 0.254: 89.15,16.76 SV3.4 89.53,16.38 87.38,14.22 83.57,14.22 81.53,12.19 TQFP-32.20
N$93
  Top 0.254: TQFP-32.21 80.77,12.95 81.28,12.95 83.06,14.73 86.87,14.73 86.87,17.02 SV3.5
N$94
  Top 0.254: TQFP-32.22 80.26,13.46 82.04,15.24 84.33,15.24 84.33,17.02 SV3.6
N$95
  Top 0.254: TQFP-32.23 79.76,13.97 81.79,16 81.79,17.02 SV3.7
N$96
  Top 0.254: TQFP-32.24 79.25,14.48 79.25,17.02 SV3.8
N$97
  Top 0.254: TQFP-32.25 76.96,14.48 76.96,17.02 SV3.9
N$98
  Top 0.254: TQFP-32.26 76.45,13.97 74.42,16 74.42,17.02 SV3.10
N$99
  Top 0.254: SV3.11 72.64,16.26 72.64,15.24 74.17,15.24 75.95,13.46 TQFP-32.27
N$100
  Top 0.254: TQFP-32.28 75.44,12.95 74.93,12.95 73.15,14.73 72.39,14.73 71.88,15.24 69.34,15.24 69.34,17.02 SV3.12
N$101
  Top 0.254: TQFP-32.29 74.68,12.19 73.66,13.21 73.15,13.21 71.63,14.73 66.8,14.73 66.8,17.02 SV3.13
N$102
  Top 0.254: TQFP-32.30 74.17,11.68 73.15,12.7 72.9,12.7 71.63,13.97 64.26,13.97 64.26,17.02 SV3.14
N$103
  Top 0.254: TQFP-32.31 73.66,11.18 71.37,13.46 61.72,13.46 61.72,17.02 SV3.15
N$104
  Top 0.254: 73.15,10.67 TQFP-32.32 | 59.18,17.02 SV3.16
  Top 0.305: 73.15,10.67 71.12,12.7 60.96,12.7 59.69,13.97 59.69,16.51 SV3.16
N$105
  Top 0.254: SOIC-16.1 70.61,30.99 72.39,29.21 72.39,28.45 74.17,26.67 SV1.1
N$106
  Top 0.254: SOIC-16.2 70.61,32.26 72.39,32.26 72.39,30.99 74.17,29.21 SV1.2
N$107
  Top 0.254: SOIC-16.3 70.61,33.53 72.64,33.53 72.64,33.27 74.17,31.75 SV1.3
N$108
  Top 0.254: SOIC-16.4 70.61,34.8 74.17,34.8 74.17,34.29 SV1.4
N$109
  Top 0.254: SOIC-16.5 70.61,36.32 74.17,36.32 74.17,36.83 SV1.5
N$110
  Top 0.254: SOIC-16.6 70.61,37.59 72.64,37.59 72.64,37.85 74.17,39.37 SV1.6
N$111
  Top 0.254: SOIC-16.7 70.61,38.86 72.39,38.86 72.39,40.13 74.17,41.91 SV1.7
N$112
  Top 0.254: SOIC-16.8 70.61,40.13 72.39,41.91 72.39,42.67 74.17,44.45 SV1.8
N$113
  Top 0.254: SOIC-16.9 65.28,40.13 63.5,41.91 63.5,42.67 61.72,44.45 SV2.1
N$114
  Top 0.254: SOIC-16.10 65.28,38.86 63.5,38.86 63.5,40.13 61.72,41.91 SV2.2
N$115
  Top 0.254: SOIC-16.11 65.28,37.59 63.25,37.59 63.25,37.85 61.72,39.37 SV2.3
N$116
  Top 0.254: SOIC-16.12 65.28,36.32 61.72,36.32 61.72,36.83 SV2.4
N$117
  Top 0.254: SOIC-16.13 65.28,34.8 61.72,34.8 61.72,34.29 SV2.5
N$118
  Top 0.254: SOIC-16.14 65.28,33.53 63.25,33.53 63.25,33.27 61.72,31.75 SV2.6
N$119
  Top 0.254: SOIC-16.15 65.28,32.26 63.5,32.26 63.5,30.99 61.72,29.21 SV2.7
N$120
  Top 0.254: SOIC-16.16 65.28,30.99 63.5,29.21 63.5,28.45 61.72,26.67 SV2.8
N$121
  Top 0.254: SV22.1 49.53,37.59 51.05,39.12 SOT23C.1
N$122
  Top 0.254: SV22.2 SOT23C.2
  Bottom 0.61: SJ2.2 SV22.2
N$123
  Top 0.254: SV22.3 54.61,37.59 53.09,39.12 SOT23C.3
N$124
  Top 0.254: SV21.1 54.61,43.69 53.09,42.16 SOT23C.4
N$125
  Top 0.254: SV21.2 SOT23C.5
  Bottom 0.61: SJ2.1 SV21.2
N$126
  Top 0.254: SV21.3 49.53,43.69 51.05,42.16 SOT23C.6
N$127
  Top 0.254: SV9.9 20.32,25.4 20.32,28.19 19.81,28.7 SOIC28.9
N$128
  Top 0.254: SV9.10 21.59,26.67 21.59,28.19 21.08,28.7 SOIC28.10
N$129
  Top 0.254: SV9.11 26.42,24.13 22.86,27.69 22.86,28.19 22.35,28.7 SOIC28.11
N$130
  Top 0.254: SV9.12 29.21,26.16 25.65,26.16 24.13,27.69 24.13,28.19 23.62,28.7 SOIC28.12
N$131
  Top 0.305: SOIC28.13 24.77,28.07 25.53,27.3 29.46,27.3 29.72,27.05 29.97,27.05 31.88,25.15 31.88,24.26 SV9.13
N$132
  Top 0.254: SV9.14 34.29,28.7 26.16,28.7 SOIC28.14
N$133
  Top 0.254: SV5.1 34.29,39.88 26.16,39.88 SOIC28.15
N$134
  Top 0.254: SV5.2 31.75,41.91 26.42,41.91 25.4,40.89 25.4,40.39 24.89,39.88 SOIC28.16
N$135
  Top 0.254: SV5.3 29.21,42.42 25.65,42.42 24.13,40.89 24.13,40.39 23.62,39.88 SOIC28.17
N$136
  Top 0.254: SV5.4 26.42,44.45 22.86,40.89 22.86,40.39 22.35,39.88 SOIC28.18
N$137
  Top 0.254: SV5.5 21.59,41.91 21.59,40.39 21.08,39.88 SOIC28.19
N$138
  Top 0.254: SV5.6 20.32,43.18 20.32,40.39 19.81,39.88 SOIC28.20
N$139
  Top 0.254: SV5.7 19.05,40.39 18.54,39.88 SOIC28.21
N$140
  Top 0.254: SV5.8 16.51,40.39 17.02,39.88 SOIC28.22
N$141
  Top 0.254: SV5.9 15.75,42.67 15.75,39.88 SOIC28.23
N$142
  Top 0.254: SV5.10 11.43,43.94 13.97,41.4 13.97,40.39 14.48,39.88 SOIC28.24
N$143
  Top 0.254: SV5.11 9.14,44.45 12.7,40.89 12.7,40.39 13.21,39.88 SOIC28.25
N$144
  Top 0.254: SV5.12 6.35,42.42 9.91,42.42 11.43,40.89 11.43,40.39 11.94,39.88 SOIC28.26
N$145
  Top 0.305: SOIC28.27 10.79,40.51 9.91,41.4 5.46,41.4 5.21,41.66 4.95,41.66 4.19,42.42 4.19,42.55 3.68,43.05 3.68,44.32 SV5.13
N$146
  Top 0.254: SV5.14 1.27,39.88 9.4,39.88 SOIC28.28
N$147
  Top 0.61: SOT23B.1 40.74,39.34 39.37,37.97 SV11.1
N$148
  Top 0.61: SOT23B.2 SV11.2
  Bottom 0.61: SJ3.2 SV11.2
N$149
  Top 0.61: SOT23B.3 42.95,39.34 44.58,37.72 44.58,36.96 SV11.3
N$150
  Top 0.61: SOT23B.4 42.85,42.22 43.69,43.05 43.81,43.05 44.58,43.81 44.58,44.32 SV10.1
N$151
  Top 0.61: SOT23B.5 SV10.2
  Bottom 0.61: SJ3.1 SV10.2
N$152
  Top 0.61: SOT23B.6 40.74,41.94 39.37,43.31 SV10.3
N$153
  Top 0.61: SOT23D.1 40.97,26.62 39.5,25.15 39.5,24.26 SV13.1
N$154
  Top 0.61: SOT23D.2 SV13.2
  Bottom 0.61: SJ1.2 SV13.2
N$155
  Top 0.61: SOT23D.3 42.85,26.49 44.45,24.89 SV13.3
N$156
  Top 0.61: SOT23D.4 42.85,29.39 44.2,30.73 44.2,31.5 SV12.1
N$157
  Top 0.61: SOT23D.5 SV12.2
  Bottom 0.61: SJ1.1 SV12.2
N$158
  Top 0.61: SOT23D.6 40.87,29.23 39.5,30.61 39.5,31.62 SV12.3
N$159
  Top 0.61: SOT23A.1 51.13,26.49 49.66,25.02 49.66,24.26 SV15.1
N$160
  Top 0.61: SOT23A.2 SV15.2
  Bottom 0.61: SJ4.2 SV15.2
N$161
  Top 0.61: SOT23A.3 53.24,26.64 54.74,25.15 54.74,24.26 SV15.3
N$162
  Top 0.61: SOT23A.4 53.01,29.39 54.48,30.86 54.48,31.62 SV14.1
N$163
  Top 0.61: SOT23A.5 SV14.2
  Bottom 0.61: SJ4.1 SV14.2
N$164
  Top 0.61: SOT23A.6 51.13,29.39 49.66,30.86 49.66,31.62 SV14.3
N$166
  Top 0.61: S1.3 9.17,13.06 PAD1.1
N$167
  Top 0.61: PAD4.1 89.86,10.92 S2.1
N$169
  Top 0.61: PAD6.1 C2.1 53.47,12.06 X1.1
N$170
  Top 0.61: PAD7.1 C1.1 53.47,9.53 X1.2
N$171  (2 unrouted)
N$173
  Top 0.61: PAD13.1 PAD11.1 PAD12.1
PLANE-SOIC16
  pour Bottom: 62.87,45.72 73.03,45.72 73.66,45.72 73.66,25.4 62.87,25.4
PLANE-SOIC20
  pour Bottom: 80.01,45.72 95.25,45.72 95.25,20.32 80.01,20.32
PLANE-SOIC28
  pour Bottom: 0.64,43.18 0.64,25.4 35.56,25.4 35.56,43.18
PLANE-TQFP32
  pour Bottom: 57.78,15.88 57.78,3.17 97.79,3.17 97.79,15.88

### Text on the board
tPlace: SMD Breakouts 1.0.2 / Dec 2014
tNames: TQFP-44
tValues: Reset | GND | GND | VCC